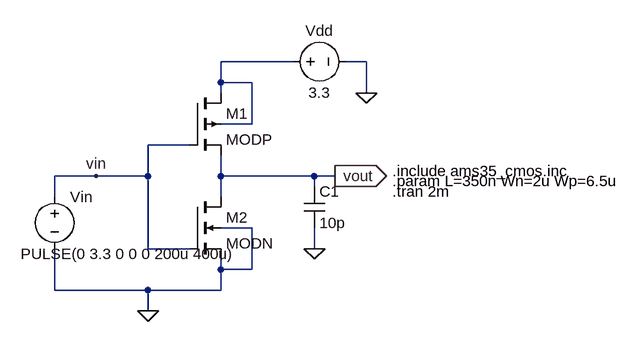
[diagram p0: schematic CMOS_Inverter_trans_analysis_pulse.asc]
CMOS_Inverter_trans_analysis_pulse.asc, the LTspice schematic file:
Version 4.1
SHEET 1 880 680
WIRE 320 -160 208 -160
WIRE 432 -160 400 -160
WIRE 208 -128 208 -160
WIRE 256 -128 208 -128
WIRE 208 -112 208 -128
WIRE 432 -112 432 -160
WIRE 256 -64 256 -128
WIRE 256 -64 208 -64
WIRE 160 -32 96 -32
WIRE 16 16 -48 16
WIRE 96 16 96 -32
WIRE 96 16 16 16
WIRE 208 16 208 -16
WIRE 352 16 208 16
WIRE 384 16 352 16
WIRE 352 32 352 16
WIRE -48 48 -48 16
WIRE 208 48 208 16
WIRE 256 96 208 96
WIRE 96 128 96 16
WIRE 160 128 96 128
WIRE 352 128 352 96
WIRE 208 160 208 144
WIRE 256 160 256 96
WIRE 256 160 208 160
WIRE -48 192 -48 128
WIRE 96 192 -48 192
WIRE 208 192 208 160
WIRE 208 192 96 192
WIRE 96 224 96 192
FLAG 96 224 0
FLAG 432 -112 0
FLAG 352 128 0
FLAG 384 16 vout
IOPIN 384 16 Out
FLAG 16 16 vin
SYMBOL nmos4 160 48 R0
SYMATTR InstName M2
SYMATTR Value2 l=L w=Wn
SYMATTR Value MODN
SYMBOL pmos4 160 -112 R0
SYMATTR InstName M1
SYMATTR Value MODP
SYMATTR Value2 l=L w=Wp
SYMBOL voltage -48 32 R0
WINDOW 123 24 108 Left 2
WINDOW 39 0 0 Left 0
WINDOW 3 -52 104 Left 2
SYMATTR Value PULSE(0 3.3 0 0 0 200u 400u)
SYMATTR InstName Vin
SYMBOL voltage 304 -160 R270
WINDOW 0 32 56 VTop 2
WINDOW 3 -32 56 VBottom 2
WINDOW 123 0 0 Left 0
WINDOW 39 0 0 Left 0
SYMATTR InstName Vdd
SYMATTR Value 3.3
SYMBOL cap 336 32 R0
SYMATTR InstName C1
SYMATTR Value 10p
TEXT 472 8 Left 2 !.include ams35_cmos.inc
TEXT 472 24 Left 2 !.param L=350n Wn=2u Wp=6.5u
TEXT 472 40 Left 2 !.tran 2m

The netlist it stands for:
* CMOS_Inverter_trans_analysis_pulse.asc
M2 vout vin 0 0 MODN l=L w=Wn
M1 N001 vin vout N001 MODP l=L w=Wp
Vin vin 0 PULSE(0 3.3 0 0 0 200u 400u)
Vdd N001 0 3.3
C1 vout 0 10p
.model NMOS NMOS
.model PMOS PMOS
.lib standard.mos
.include ams35_cmos.inc
.param L=350n Wn=2u Wp=6.5u
.tran 2m
.backanno
.end